# EAGLE design tyraka2.1 (EAGLE 9.6.1)
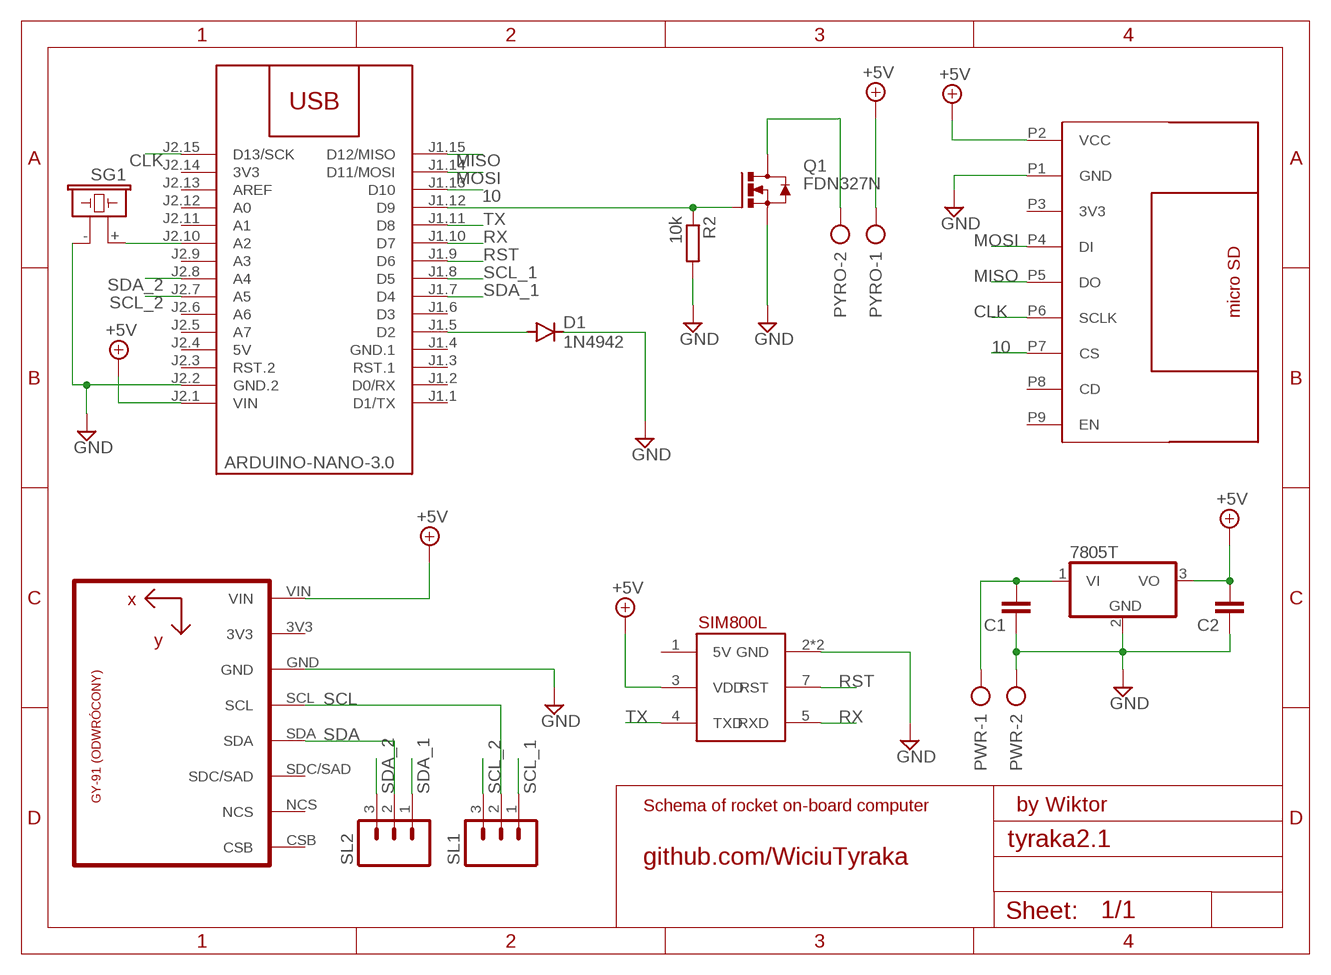
[diagram p0: schematic, sheet 1]

## Parts
C1  C2.5/4  [C2.5-4]
C2  C2.5/4  [C2.5-4]
D1  1N4942  [DO41-10]
IC2  7805T  [TO220H]
M1  ARDUINO-NANO-3.0  [ARDUINO-NANO-3.0]
PWR  AK500/2  [AK500/2]
PYRO  AK500/2  [AK500/2]
Q1  FDN327N  MOSFET_N_SOT231  [SOT23]
R2  10k  R-EU_0204/5  [0204/5]
SD1  MICRO_SD  [MICRO_SD]
SG1  F/CM12P  [F/CM12P]
SL1  M03  [03P]
SL2  M03  [03P]
U1  GY-521MPU6050  [GY-521]
U$1  SIM800L  [SIP]

## Nets
10: M1.J1.13(D10) SD1.P7(CS)
+5V: C2.2 IC2.3(VO) M1.J2.1(VIN) PYRO.1 SD1.P2(VCC) U1.VIN U$1.3(VDD)
CLK: M1.J2.15(D13/SCK) SD1.P6(SCLK)
GND: C1.1 C2.1 D1.C IC2.2(GND) M1.J2.2(GND.2) PWR.2 Q1.2(S) R2.2 SD1.P1(GND) SG1.- U1.GND U$1.2(GND) U$1.6(GND)
MISO: M1.J1.15(D12/MISO) SD1.P5(DO)
MOSI: M1.J1.14(D11/MOSI) SD1.P4(DI)
N$2: PYRO.2 Q1.3(D)
N$3: M1.J1.12(D9) Q1.1(G) R2.1
N$5: D1.A M1.J1.5(D2)
N$6: M1.J2.10(A2) SG1.+
N$8: C1.2 IC2.1(VI) PWR.1
RST: M1.J1.9(D6) U$1.7(RST)
RX: M1.J1.10(D7) U$1.5(RXD)
SCL: SL1.2 U1.SCL
SCL_1: M1.J1.8(D5) SL1.1
SCL_2: M1.J2.7(A5) SL1.3
SDA: SL2.2 U1.SDA
SDA_1: M1.J1.7(D4) SL2.1
SDA_2: M1.J2.8(A4) SL2.3
TX: M1.J1.11(D8) U$1.4(TXD)
Unconnected: M1.J1.1(D1/TX) M1.J1.2(D0/RX) M1.J1.3(RST.1) M1.J1.6(D3) M1.J2.3(RST.2) M1.J2.5(A7) M1.J2.6(A6) M1.J2.9(A3) M1.J2.11(A1) M1.J2.12(A0) M1.J2.13(AREF) SD1.P3(3V3) SD1.P8(CD) SD1.P9(EN) U1.3V3 U1.CSB U1.NCS U1.SDC/SAD U$1.1(5V)

## Notes on the sheet
- Schema of rocket on-board computer | by Wiktor
- github.com/WiciuTyraka

## Power pins joined to a net without a drawn wire
3V3: M1.J2.14(3V3)
5V: M1.J2.4(5V)
GND.1: M1.J1.4(GND.1)

## Library data of the parts
C1 C2 = capacitor-wima:C: CAPACITOR naming: grid - package width
D1 = diode:1N4942: DIODE 1.0 A, 200 V, 150 ns
IC2 = linear:78*: Positive VOLTAGE REGULATOR Source: http://cache.national.com/ds/LM/LM78L05.pdf http://www.fairchildsemi.com/ds/LM/LM7805.pdf
M1 = ads1115:ARDUINO-NANO-3.0: Arduino Nano 3.0 and compatible devices More details available here: https://www.arduino.cc/en/Main/ArduinoBoardNano Click here to find device on ebay.com <http://www.ebay.com/sch/arduino+nano>
PWR PYRO = con-ptr500:AK500/2: CONNECTOR; OC_FARNELL: unknown; OC_NEWARK: unknown
Q1 = m-pad-2.1:MOSFET_N_SOT23: n channel mosfets in the sot-23 package standard pinout ie. fairchildsemi.com: FDN327N FDN335N FDN337N FDN372S NDS355AN etc. ie fairchild at digikey: FDV303N NDS351N NDS355N etc.
R2 = rcl:R-EU_: RESISTOR, European symbol; SPICEPREFIX: R
SD1 = 111_microsd:MICRO_SD
SG1 = buzzer:F/CM12P: BUZZER Source: Buerklin; OC_FARNELL: unknown; OC_NEWARK: unknown
SL1 SL2 = con-amp-quick:M03: AMP QUICK CONNECTOR; OC_FARNELL: unknown; OC_NEWARK: unknown
U1 = 111_BAROMETR:GY-521
U$1 = SIM800L:SIM800L: SIM800L Blue EVB Board with Level Translation and diode dropper.

## Board
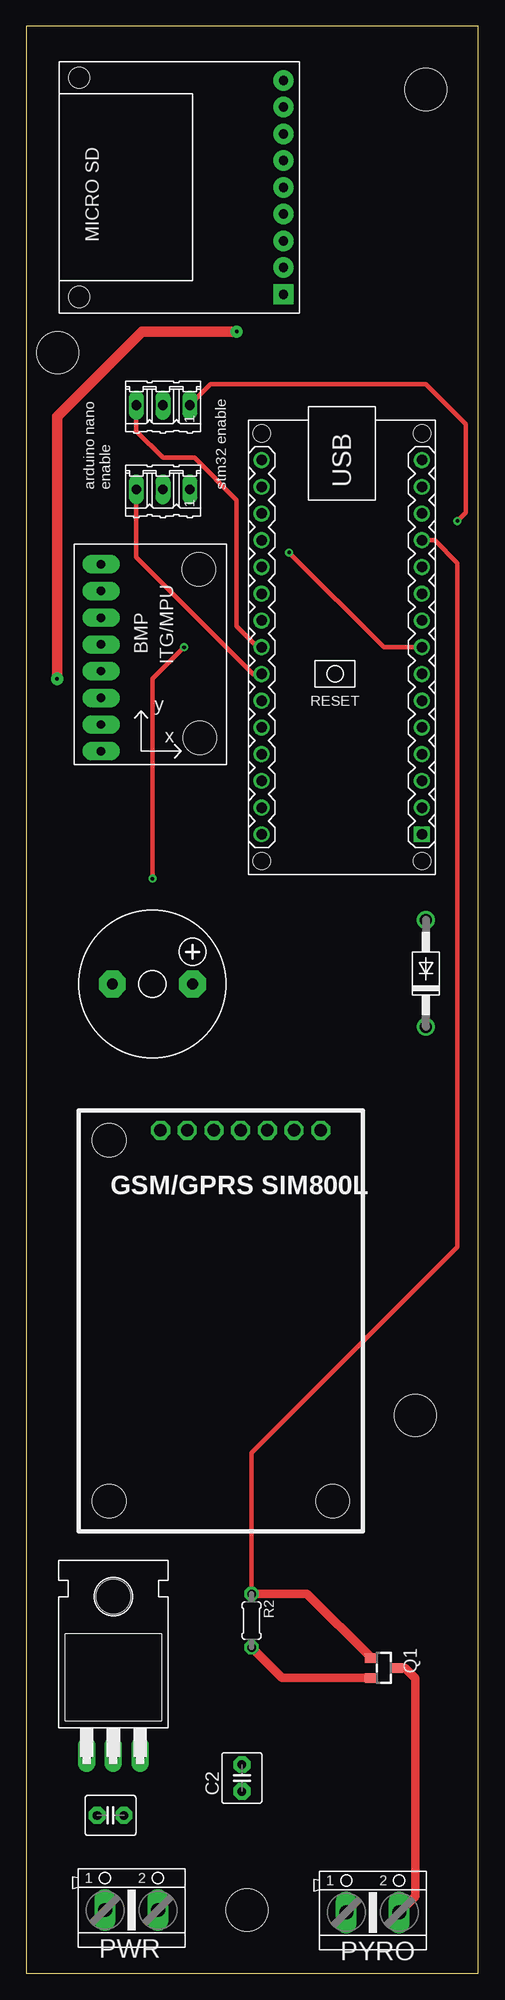
[diagram p1: board, top side]
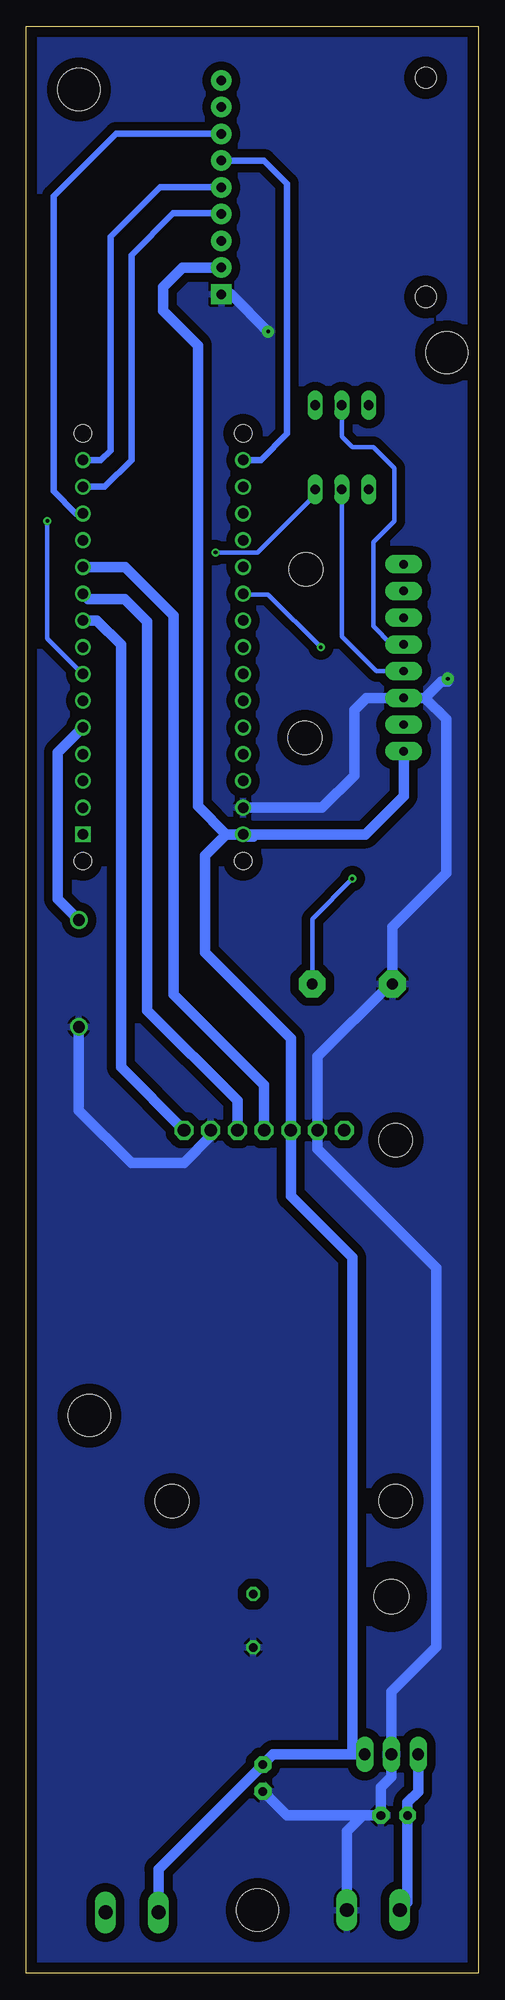
[diagram p2: board, bottom side, seen from below]

Size 43 x 185 mm. Coordinates in mm from the lower left corner, seen from the top.
Outline: 0,0 43,0 43,185 0,185 0,0
Copper layers (1*16): Top 0.035mm / dielectric 1.5mm / Bottom 0.035mm
Design rules "default": minimum track width 6mil, minimum drill 0.35mm, track to track 6mil, track to pad 6mil, pad to pad 6mil, via to via 6mil, smd to smd 6mil, copper to edge 40mil, drill to drill 6mil, minimum pad ring 10mil, minimum via ring 8mil, stop-mask expansion 4mil, vias tented up to drill 0mil, thermal gap 10mil
Holes 4 mm at 38,179 3,154 21,6 37,53

### Footprints (pad centres in the part's own frame; a part is rotated, then mirrored left to right if it is on the bottom)
C2.5-4 = drill 0.813 pad 1.6 octagon: 1 -1.27,0; 2 1.27,0
DO41-10 = drill 1.118: A 5.08,0; C -5.08,0
TO220H = drill 1.118 long: 1 -2.54,-10.16; 2 0,-10.16; 3 2.54,-10.16 | hole 3.302: 0,4.826
ARDUINO-NANO-3.0 = drill 1 square: J1.1 17.78,7.62 | drill 1: J1.2 15.24,7.62; J1.3 12.7,7.62; J1.4 10.16,7.62; J1.5 7.62,7.62; J1.6 5.08,7.62; J1.7 2.54,7.62; J1.8 0,7.62; J1.9 -2.54,7.62; J1.10 -5.08,7.62; J1.11 -7.62,7.62; J1.12 -10.16,7.62; J1.13 -12.7,7.62; J1.14 -15.24,7.62; J1.15 -17.78,7.62; J2.1 17.78,-7.62; J2.2 15.24,-7.62; J2.3 12.7,-7.62; J2.4 10.16,-7.62; J2.5 7.62,-7.62; J2.6 5.08,-7.62; J2.7 2.54,-7.62; J2.8 0,-7.62; J2.9 -2.54,-7.62; J2.10 -5.08,-7.62; J2.11 -7.62,-7.62; J2.12 -10.16,-7.62; J2.13 -12.7,-7.62; J2.14 -15.24,-7.62; J2.15 -17.78,-7.62 | hole 1.651: -20.32,7.62; -20.32,-7.62; 20.32,-7.62; 20.32,7.62
AK500/2 = drill 1.321 long: 1 -2.515,0; 2 2.515,0
SOT23 = smd 0.9 x 1.2: 1 -0.95,-1.2; 2 0.95,-1.2; 3 0,1.2
0204/5 = drill 0.813 octagon: 1 -2.54,0; 2 2.54,0
MICRO_SD = drill 0.9 pad 1.93 square: P1 -9.906,10.16 | drill 0.9 pad 1.93: P2 -9.906,7.62; P3 -9.906,5.08; P4 -9.906,2.54; P5 -9.906,0; P6 -9.906,-2.54; P7 -9.906,-5.08; P8 -9.906,-7.62; P9 -9.906,-10.16 | hole 2: 9.525,-10.414; 9.525,10.414
F/CM12P = drill 1.016 pad 2.54 octagon: + 3.81,0; - -3.81,0
03P = drill 0.914 long: 1 -2.54,0; 2 0,0; 3 2.54,0
GY-521 = drill 0.8 pad 1.778 long: 3V3 -8.89,-6.35; CSB -8.89,8.89; GND -8.89,-3.81; NCS -8.89,6.35; SCL -8.89,-1.27; SDA -8.89,1.27; SDC/SAD -8.89,3.81; VIN -8.89,-8.89 | hole 3.2: 0.4,8.4; 0.5,-7.6
SIP = drill 1.2 octagon: 1 38.1,19.24; 2 38.1,16.7; 3 38.1,14.16; 4 38.1,11.62; 5 38.1,9.08; 6 38.1,6.54; 7 38.1,4 | hole 3.2: 2.87,24.13; 2.87,2.87; 37.16,24.13

### Placement (x,y rotation side)
C1  8.01,14.99 180 top
C2  20.5,18.55 90 top
D1  38,95 90 top
IC2  8.28,30.96 0 top
M1  30,126 270 top
PWR  10,6 0 top
PYRO  32.95,5.77 0 top
Q1  34,29 270 top
R2  21.42,33.5 270 top
SD1  14.55,169.7 180 top
SG1  12,94 0 top
SL1  13,141 180 top
SL2  13,149 180 top
U1  16,125 0 top
U$1  32,42 90 top

### Tracks (layer width: path | path; a pad name or v marks a point on that pad's centre or on a via)
10
  Bottom 0.61: SD1.P7 34.46,174.78 40.4,168.83 40.4,140.82 38.28,138.7 M1.J1.13
+5V
  Bottom 0.813: PYRO.1 31,6.34
  Bottom 1.016: IC2.3 12,20.8 | 24.54,162 SD1.P2 28.14,162.08 30,160.22 30,158 26.67,154.67 26.67,110.9 23.99,108.22 | M1.J2.1 10.75,108.22 7.11,111.86 U1.VIN | 21.41,108.03 22.19,108.03 M1.J2.1 | 12,20.8 19.52,20.8 C2.2 30.43,9.88 PYRO.1 | M1.J2.1 23.99,108.22 | 12,20.8 12,68 17.84,73.84 U$1.3 17.84,88.84 26,97 26,106.21 23.99,108.22
CLK
  Bottom 0.61: M1.J2.15 20.69,143.78 18.19,146.28 18.19,170.04 20.39,172.24 SD1.P6
GND  (via drill 0.35 pad 1.15)
  Top 0.813: Q1.2 24.33,28.05 R2.2
  Top 1.016: v2.92,123 2.92,147.92 11,156 v20,156
  Bottom 1.016: M1.J2.2 14.88,110.76 11.81,113.82 11.81,120.05 10.67,121.19 U1.GND 5.08,121.19 | 5.08,121.19 3.05,119.16 3.05,104.55 8.19,99.41 SG1.- 8.39,94 15.3,87.09 U$1.2 15.3,78.3 4,67 4,31 8.28,26.72 IC2.2 8.28,18.64 9.28,17.64 C1.1 11.01,14.99 | PWR.2 12.52,13.48 11.01,14.99 | C2.1 18.21,14.99 11.01,14.99 | D1.C 38,82 33,77 28,77 25.46,79.54 U$1.6 | 5.08,121.19 3.56,122.71 2.92,122.71 v2.92,123 | v20,156 23.54,159.54 SD1.P1
  pour Bottom (isolate 0.813): 0,185 43,185 43,0 0,0
MISO
  Bottom 0.61: M1.J1.15 35.92,143.78 35,144.7 35,165 30.3,169.7 SD1.P5
MOSI
  Bottom 0.61: M1.J1.14 35.54,141.24 33,143.78 33,163.25 29.02,167.23 24.53,167.23 SD1.P4
N$2
  Top 0.813: Q1.3 36,29 37,28 37,7.3 PYRO.2
N$3
  Top 0.406: R2.1 21.42,49.42 41,69 41,134 38.84,136.16 M1.J1.12
  Top 0.813: Q1.1 26.71,36.04 R2.1
N$5
  Bottom 1.016: M1.J1.5 40.01,116 40.01,102.08 D1.A
N$6  (via drill 0.35)
  Top 0.406: v12,104 12,123 v15,126
  Bottom 0.406: 22.3,131 20,131 v15,126 | v12,104 15.81,100.19 SG1.+
  Bottom 1.016: M1.J2.10 22.3,131
N$8
  Bottom 1.016: IC2.1 5.74,17.26 6.74,16.26 C1.2 6.74,6.74 PWR.1
RST
  Bottom 1.016: U$1.7 34,86.1 34,126.23 36.31,128.54 M1.J1.9
RX
  Bottom 1.016: M1.J1.10 37.13,130.59 33.66,130.59 31.5,128.43 31.5,91.5 22.92,82.92 U$1.5
SCL
  Bottom 0.406: U1.SCL 9.73,123.73 13,127 SL1.2
SCL_1  (via drill 0.35)
  Top 0.406: v25,135 34,126 M1.J1.8
  Bottom 0.406: SL1.1 15.54,140.46 21,135 v25,135
SCL_2
  Top 0.406: SL1.3 10.46,134.54 21.54,123.46 M1.J2.7
SDA
  Bottom 0.406: U1.SDA 8.27,126.27 10,128 10,136 8,138 8,143 10,145 12,145 13,146 SL2.2
SDA_1  (via drill 0.35)
  Top 0.406: SL2.1 17.54,151 38,151 41.78,147.22 41.78,138.78 v41,138
  Bottom 0.406: v41,138 41,126.84 M1.J1.7
SDA_2
  Top 0.406: SL2.3 10.46,146.54 13,144 16,144 20,140 20,128 22,126 M1.J2.8
TX
  Bottom 1.016: U$1.4 20.38,84.38 29,93 29,129 33.62,133.62 M1.J1.11

### Text on the board
tPlace: arduino nano / enable | stm32 enable | GSM/GPRS SIM800L
bPlace: C:/Users/Wiciu/Desktop/tyraka4.bmp